# Altium schematic sheet SAMD21_Xplained_Pro_Target_MCU.SchDoc: Target MCU
size A3; Organization: ATMEL Norway; Address1: Vestre Rosten 79; Address2: N-7075 TILLER; Address3: NORWAY; DocumentNumber: A09-2130; Revision: 2; SheetNumber: 4; SheetTotal: 5; PageSetup: Record=PageOptions|CenterHorizontal=True|CenterVertical=True|PrintScale=1.01|XCorrection=1.00|YCorrection=1.00|PrintKind=1|BorderSize=5000000|LeftOffset=0|BottomOffset=0|Orientation=2|PaperLength=1000|PaperWidth=1000|Scale=100|PaperSource=7|PrintQuality=-4|MediaType=1|DitherType=10|PaperKind=A3 (297 x 420 mm)|PrintScaleMode=1
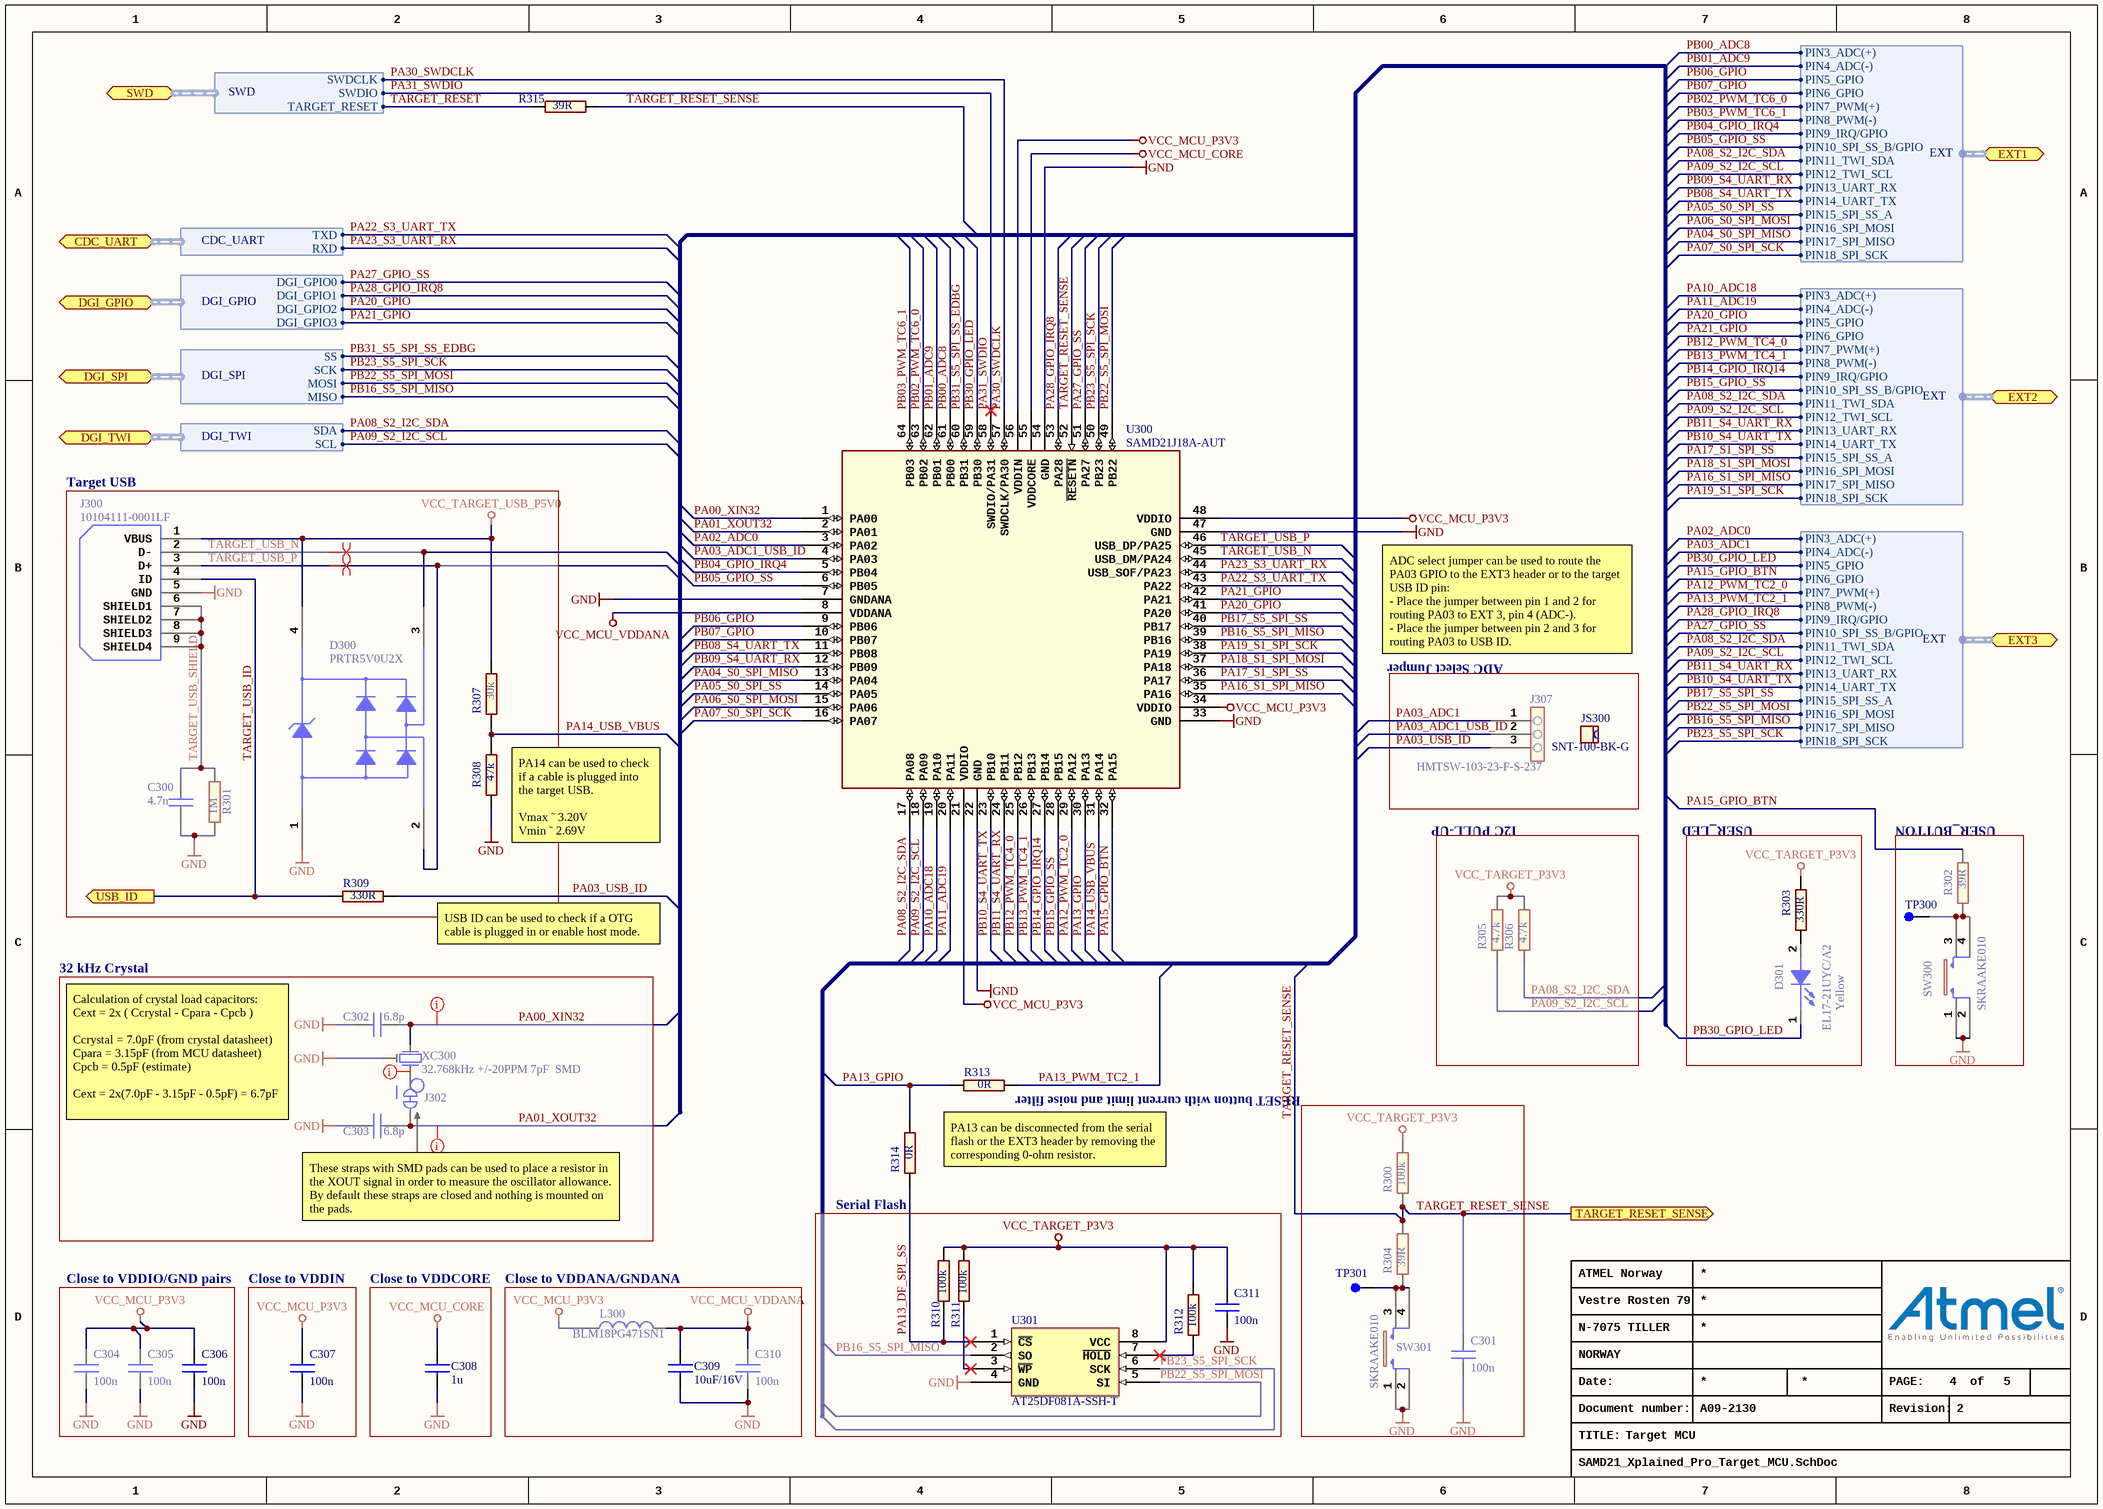
[diagram p0: SAMD21_Xplained_Pro_Target_MCU.SchDoc]

## Parts
C300  value 4.7n  [AP1-00053]  (hidden comment: CAP-NONPOL)
C301  100n  [AP1-00053]
C302  value 6.8p  [AP1-00001]  (hidden comment: CAP-NONPOL)
C303  value 6.8p  [AP1-00001]  (hidden comment: CAP-NONPOL)
C304  value 100n  [AP1-00001]  (hidden comment: CAP-NONPOL)
C305  value 100n  [AP1-00001]  (hidden comment: CAP-NONPOL)
C306  value 100n  [AP1-00001]  (hidden comment: CAP-NONPOL)
C307  value 100n  [AP1-00001]  (hidden comment: CAP-NONPOL)
C308  value 1u  [AP1-00001]  (hidden comment: CAP-NONPOL)
C309  value 10uF/16V  [AP1-00039]  (hidden comment: CAP-NONPOL)
C310  value 100n  [AP1-00001]  (hidden comment: CAP-NONPOL)
C311  100n  [AP1-00001]
D300  PRTR5V0U2X  [AP4-00001]
D301  Yellow  value EL17-21UYC/A2  [AP4-00013]
J300  value 10104111-0001LF  [AP8-00604]  (hidden comment: USB_AB)
J302  (no value)  [AP9-00044]  (net tie, no BOM)
J307  value HMTSW-103-23-F-S-237  [AP8-00745]  (hidden comment: Same as A08-1614 but with 1mm hole for optimal reflow soldering (no misalignment of the component))
JS300  value SNT-100-BK-G  [AP8-00525]
L300  BLM18PG471SN1  [AP3-00005]
R300  value 100k  [AP2-00011]  (hidden comment: R2)
R301  value 1M  [AP2-00011]  (hidden comment: R2)
R302  value 39R  [AP2-00011]  (hidden comment: R2)
R303  value 330R  [AP2-00000]  (hidden comment: R2)
R304  value 39R  [AP2-00011]  (hidden comment: R2)
R305  value 4.7k  [AP2-00000]  (hidden comment: R2)
R306  value 4.7k  [AP2-00000]  (hidden comment: R2)
R307  value 30k  [AP2-00000]  (hidden comment: R2)
R308  value 47k  [AP2-00000]  (hidden comment: R2)
R309  value 330R  [AP2-00000]  (hidden comment: R2)
R310  value 100k  [AP2-00000]  (hidden comment: R2)
R311  value 100k  [AP2-00000]  (hidden comment: R2)
R312  value 100k  [AP2-00000]  (hidden comment: R2)
R313  value 0R  [AP2-00000]  (hidden comment: R2)
R314  value 0R  [AP2-00000]  (hidden comment: R2)
R315  value 39R  [AP2-00011]  (hidden comment: R2)
SW300  value SKRAAKE010  [AP8-00137]  (hidden comment: Can be ordered in low volumes from Mouser)
SW301  value SKRAAKE010  [AP8-00137]  (hidden comment: Can be ordered in low volumes from Mouser)
TP300  TESTPOINT  [AP8-00010]  (value not drawn)  (no BOM)
TP301  TESTPOINT  [AP8-00010]  (value not drawn)  (no BOM)
U300  value SAMD21J18A-AUT  [AP6-00173]  (hidden comment: TQFP64)
U301  value AT25DF081A-SSH-T  [AP8-00417]  (hidden comment: AT25DF081A)
XC300  value 32.768kHz +/-20PPM 7pF  SMD  [AP7-00044]  (hidden comment: Farnell order no:1539364)

## Blocks framed on the sheet
Target USB: C300 D300 J300 R301 R307-R309
ADC Select Jumper: J307 JS300
I2C PULL-UP: R305 R306
USER_LED: D301 R303
USER_BUTTON: R302 SW300 TP300
32 kHz Crystal: C302 C303 J302 XC300
RESET button with current limit and noise filter: C301 R300 R304 SW301 TP301
Serial Flash: C311 R310-R312 U301
Close to VDDIO/GND pairs: C304-C306
Close to VDDIN: C307
Close to VDDCORE: C308
Close to VDDANA/GNDANA: C309 C310 L300

## Ports
CDC_UART (harness CDC_UART), DGI_GPIO (harness DGI_GPIO), DGI_SPI (harness DGI_SPI), DGI_TWI (harness DGI_TWI), EXT1 (harness EXT), EXT2 (harness EXT), EXT3 (harness EXT), SWD (harness SWD), TARGET_RESET_SENSE (out), USB_ID (out)

## Harnesses
SWD: SWDCLK, SWDIO, TARGET_RESET
DGI_GPIO: DGI_GPIO0, DGI_GPIO1, DGI_GPIO2, DGI_GPIO3
DGI_SPI: MISO, MOSI, SCK, SS
DGI_TWI: SCL, SDA
CDC_UART: RXD, TXD
EXT: PIN10_SPI_SS_B/GPIO, PIN11_TWI_SDA, PIN12_TWI_SCL, PIN13_UART_RX, PIN14_UART_TX, PIN15_SPI_SS_A, PIN16_SPI_MOSI, PIN17_SPI_MISO, PIN18_SPI_SCK, PIN3_ADC(+), PIN4_ADC(-), PIN5_GPIO, PIN6_GPIO, PIN7_PWM(+), PIN8_PWM(-), PIN9_IRQ/GPIO

## Nets
GND: C300.1 C301.2 C302.2 C303.2 C304.2 C305.2 C306.2 C307.2 C308.2 C309.2 C310.2 C311.2 D300.1(GND) J300.5(GND) R301.1 R308.1 SW300.1 SW300.2 SW301.1 SW301.2 U300.7(GNDANA) U300.22(GND) U300.33(GND) U300.47(GND) U300.54(GND) U301.4(GND) XC300.3
VCC_MCU_CORE: C308.1 U300.55(VDDCORE)
VCC_MCU_P3V3: C304.1 C305.1 C306.1 C307.1 L300.1 U300.21(VDDIO) U300.34(VDDIO) U300.48(VDDIO) U300.56(VDDIN)
VCC_MCU_VDDANA: C309.1 C310.1 L300.2 U300.8(VDDANA)
VCC_TARGET_P3V3: C311.1 R300.2 R303.2 R305.2 R306.2 R310.1 R311.1 R312.2 U301.8(VCC)
VCC_TARGET_USB_P5V0: D300.4(VCC) J300.1(VBUS) R307.2
PA00_XIN32: C302.1 U300.1(PA00) XC300.2
PA01_XOUT32: C303.1 J302.2 U300.2(PA01)
PA02_ADC0: U300.3(PA02) ; port EXT3.PIN3_ADC(+)
PA03_ADC1: J307.1 ; port EXT3.PIN4_ADC(-)
PA03_ADC1_USB_ID: J307.2 U300.4(PA03)
PA03_USB_ID: J307.3 R309.2
PA04_S0_SPI_MISO: U300.13(PA04) ; port EXT1.PIN17_SPI_MISO
PA05_S0_SPI_SS: U300.14(PA05) ; port EXT1.PIN15_SPI_SS_A
PA06_S0_SPI_MOSI: U300.15(PA06) ; port EXT1.PIN16_SPI_MOSI
PA07_S0_SPI_SCK: U300.16(PA07) ; port EXT1.PIN18_SPI_SCK
PA08_S2_I2C_SDA: R306.1 U300.17(PA08) ; port DGI_TWI.SDA, port EXT1.PIN11_TWI_SDA, port EXT2.PIN11_TWI_SDA, port EXT3.PIN11_TWI_SDA
PA09_S2_I2C_SCL: R305.1 U300.18(PA09) ; port DGI_TWI.SCL, port EXT1.PIN12_TWI_SCL, port EXT2.PIN12_TWI_SCL, port EXT3.PIN12_TWI_SCL
PA10_ADC18: U300.19(PA10) ; port EXT2.PIN3_ADC(+)
PA11_ADC19: U300.20(PA11) ; port EXT2.PIN4_ADC(-)
PA12_PWM_TC2_0: U300.29(PA12) ; port EXT3.PIN7_PWM(+)
PA13_DF_SPI_SS: R310.2 R314.1 U301.1(~{CS})
PA13_GPIO: R313.2 R314.2 U300.30(PA13)
PA13_PWM_TC2_1: R313.1 ; port EXT3.PIN8_PWM(-)
PA14_USB_VBUS: R307.1 R308.2 U300.31(PA14)
PA15_GPIO_BTN: R302.2 U300.32(PA15) ; port EXT3.PIN6_GPIO
PA16_S1_SPI_MISO: U300.35(PA16) ; port EXT2.PIN17_SPI_MISO
PA17_S1_SPI_SS: U300.36(PA17) ; port EXT2.PIN15_SPI_SS_A
PA18_S1_SPI_MOSI: U300.37(PA18) ; port EXT2.PIN16_SPI_MOSI
PA19_S1_SPI_SCK: U300.38(PA19) ; port EXT2.PIN18_SPI_SCK
PA20_GPIO: U300.41(PA20) ; port DGI_GPIO.DGI_GPIO2, port EXT2.PIN5_GPIO
PA21_GPIO: U300.42(PA21) ; port DGI_GPIO.DGI_GPIO3, port EXT2.PIN6_GPIO
PA22_S3_UART_TX: U300.43(PA22) ; port CDC_UART.TXD
PA23_S3_UART_RX: U300.44(USB_SOF/PA23) ; port CDC_UART.RXD
PA27_GPIO_SS: U300.51(PA27) ; port DGI_GPIO.DGI_GPIO0, port EXT3.PIN10_SPI_SS_B/GPIO
PA28_GPIO_IRQ8: U300.53(PA28) ; port DGI_GPIO.DGI_GPIO1, port EXT3.PIN9_IRQ/GPIO
PA30_SWDCLK: U300.57(SWDCLK/PA30) ; port SWD.SWDCLK
PA31_SWDIO: U300.58(SWDIO/PA31) ; port SWD.SWDIO
PB00_ADC8: U300.61(PB00) ; port EXT1.PIN3_ADC(+)
PB01_ADC9: U300.62(PB01) ; port EXT1.PIN4_ADC(-)
PB02_PWM_TC6_0: U300.63(PB02) ; port EXT1.PIN7_PWM(+)
PB03_PWM_TC6_1: U300.64(PB03) ; port EXT1.PIN8_PWM(-)
PB04_GPIO_IRQ4: U300.5(PB04) ; port EXT1.PIN9_IRQ/GPIO
PB05_GPIO_SS: U300.6(PB05) ; port EXT1.PIN10_SPI_SS_B/GPIO
PB06_GPIO: U300.9(PB06) ; port EXT1.PIN5_GPIO
PB07_GPIO: U300.10(PB07) ; port EXT1.PIN6_GPIO
PB08_S4_UART_TX: U300.11(PB08) ; port EXT1.PIN14_UART_TX
PB09_S4_UART_RX: U300.12(PB09) ; port EXT1.PIN13_UART_RX
PB10_S4_UART_TX: U300.23(PB10) ; port EXT2.PIN14_UART_TX, port EXT3.PIN14_UART_TX
PB11_S4_UART_RX: U300.24(PB11) ; port EXT2.PIN13_UART_RX, port EXT3.PIN13_UART_RX
PB12_PWM_TC4_0: U300.25(PB12) ; port EXT2.PIN7_PWM(+)
PB13_PWM_TC4_1: U300.26(PB13) ; port EXT2.PIN8_PWM(-)
PB14_GPIO_IRQ14: U300.27(PB14) ; port EXT2.PIN9_IRQ/GPIO
PB15_GPIO_SS: U300.28(PB15) ; port EXT2.PIN10_SPI_SS_B/GPIO
PB16_S5_SPI_MISO: U300.39(PB16) U301.2(SO) ; port DGI_SPI.MISO, port EXT3.PIN17_SPI_MISO
PB17_S5_SPI_SS: U300.40(PB17) ; port EXT3.PIN15_SPI_SS_A
PB22_S5_SPI_MOSI: U300.49(PB22) U301.5(SI) ; port DGI_SPI.MOSI, port EXT3.PIN16_SPI_MOSI
PB23_S5_SPI_SCK: U300.50(PB23) U301.6(SCK) ; port DGI_SPI.SCK, port EXT3.PIN18_SPI_SCK
PB30_GPIO_LED: D301.1(CATHODE) U300.59(PB30) ; port EXT3.PIN5_GPIO
PB31_S5_SPI_SS_EDBG: U300.60(PB31) ; port DGI_SPI.SS
TARGET_RESET: R315.1 ; port SWD.TARGET_RESET
TARGET_RESET_SENSE: C301.1 R300.1 R304.2 R315.2 U300.52(~{RESETN}) ; port TARGET_RESET_SENSE
TARGET_USB_ID: J300.4(ID) R309.1 ; port USB_ID
TARGET_USB_N: D300.3(I/O_2) J300.2(D-) U300.45(USB_DM/PA24)
TARGET_USB_P: D300.2(I/O_1) J300.3(D+) U300.46(USB_DP/PA25)
TARGET_USB_SHIELD: C300.2 J300.6(SHIELD1) J300.7(SHIELD2) J300.8(SHIELD3) J300.9(SHIELD4) R301.2
NetD301_2: D301.2(ANODE) R303.1
NetJ302_1: J302.1 XC300.1
NetR302_1: R302.1 SW300.3 SW300.4 TP300.1
NetR304_1: R304.1 SW301.3 SW301.4 TP301.1
NetR311_2: R311.2 U301.3(~{WP})
NetR312_1: R312.1 U301.7(~{HOLD})

## Layout directives
rule Assembly Testpoint Usage [Testpoint - Not Allowed    Multiple - Not Allowed]: NetJ302_1, PA00_XIN32, PA01_XOUT32
differential pair; rule Assembly Testpoint Usage [Testpoint - Not Allowed    Multiple - Not Allowed]: TARGET_USB_N, TARGET_USB_P

## Notes on the sheet
- ADC select jumper can be used to route the PA03 GPIO to the EXT3 header or to the target USB ID pin:
  - Place the jumper between pin 1 and 2 for routing PA03 to EXT 3, pin 4 (ADC-).
  - Place the jumper between pin 2 and 3 for routing PA03 to USB ID.
- (near R308) PA14 can be used to check
  if a cable is plugged into
  the target USB.
  Vmax ˜ 3.20V
  Vmin ˜ 2.69V
- USB ID can be used to check if a OTG cable is plugged in or enable host mode.
- Calculation of crystal load capacitors:
  Cext = 2x ( Ccrystal - Cpara - Cpcb )
  Ccrystal = 7.0pF (from crystal datasheet)
  Cpara = 3.15pF (from MCU datasheet)
  Cpcb = 0.5pF (estimate)
  Cext = 2x(7.0pF - 3.15pF - 0.5pF) = 6.7pF
- PA13 can be disconnected from the serial flash or the EXT3 header by removing the corresponding 0-ohm resistor.
- These straps with SMD pads can be used to place a resistor in the XOUT signal in order to measure the oscillator allowance.
  By default these straps are closed and nothing is mounted on the pads.
- Date:
- PAGE:
- of
- TITLE:
- Document number:
- Revision:

## Library data of the parts
C300 = A01-0046: Ceramic capacitor, SMD 0402, X7R, 25V, +/-10%; PartGroup: Capacitors,Ceramic,SMD 0402; TemperatureRange: -55 - +125 deg C; AN: A01-0046; Tolerance: 25V, +/-10%; Height: 0.550000011920929
C301 C304-C307 C310 C311 = A01-0246: Ceramic capacitor, SMD 0402, X7R, 16V, +/-10%; PartGroup: Capacitors,Ceramic,SMD 0402; Manufacturer: Kemet; MPN: C0402C104K4RACTU; TemperatureRange: -55 - +125 deg C; AN: A01-0246; Tolerance: 16V, +/-10%; Height: 0,5
  C301 C311: Value: 100n
C302 C303 = A01-0013: Ceramic capacitor, SMD 0402, NP0, 50V, +/-5%; PartGroup: Capacitors,Ceramic,SMD 0402; TemperatureRange: -55 - +125 deg C; AN: A01-0013; Tolerance: 50V, +/-5%; Height: 0,550000011920929
C308 = A01-0286: Ceramic capacitor, SMD 0402, X5R, 6.3V, +/-10% (de26942); PartGroup: Capacitors,Ceramic,SMD 0402; Manufacturer: Kemet; MPN: C0402C105K9PAC; TemperatureRange: -55 to 85 deg C; AN: A01-0286; Tolerance: +/-10%; Height: 0,5
C309 = A01-0491: Ceramic capacitor, SMD 0603, X5R, 16V, 10UF ± 20% (High Density); PartGroup: Capacitors,Ceramic,SMD 0603; Manufacturer: Taiyo Yuden; MPN: EMK107BBJ106MA-T; AN: A01-0491
D300 = A06-0236: Double rail-to-rail USB ESD protection diode; OrcadPartType: Integrated Circuits&Special function&Protection; Manufacturer: Philips; TemperatureRange: -40 to +85 C; AN: A06-0236; Value: PRTR5V0U2X; PartType: Buy; Height: 1,10000002384186; MPN: PRTR5V0U2X
D301 = A10-0019: LED, Yellow, Wave length=591nm, SMD 0805, ±70°; PartGroup: Opto,LEDs,SMD; Manufacturer: Everlight; MPN: 17-21UYC/S530-A3/TR8; TemperatureRange: -40 to +85 deg C; AN: A10-0019; Height: 1,10000002384186
J300 = A08-1368: Micro USB AB Connector; PartGroup: Mechanical devices,Connectors,USB; Manufacturer: FCI; AN: A08-1368; Height: 2.59999990463257; MPN: 10104111-0001LF
J302 = A09-0783: Default closed SMD strap, 0603 size; PartGroup: Mechanical devices,PCB implemented components; Value: SMD-STRAP_0603_CLOSED; AN: A09-0783; Height: 0
J307 = A08-1799: 1x3 pin header, 2.54mm pitch, Pin-in-Paste THM, 1mm hole; PartGroup: Mechanical devices,Connectors,Pin headers; Manufacturer: SAMTEC; AN: A08-1799; Height: 6,09999990463257; MPN: HMTSW-103-23-F-S-237
JS300 = A08-0543: Jumper cap for 2.54mm pinheader; PartGroup: Mechanical devices,Mounting accessories,Other; Manufacturer: SAMTEC; AN: A08-0543; MPN: SNT-100-BK-G
L300 = A03-0035: SMD RF inductor 0603. Z=470Ohm (@100MHz), Max R(dc)=0.65Ohm, Max current=1A; PartGroup: Inductors,EMI; Manufacturer: Murata; Tolerance: ±25%; TemperatureRange: -55°C to +125°C; AN: A03-0035; Value: BLM18PG471SN1; Height: 0,800000011920929; MPN: BLM18PG471SN1
R300 R310-R312 = A02-0260: Thick film resistor, SMD 0402, 1/16W, 1%; PartGroup: Resistors,SMD,0402 1%; TemperatureRange: -55 - +125 deg C; AN: A02-0260; Tolerance: 1 %; Height: 0,349999994039536
R301 = A02-0284: Thick film resistor, SMD 0402, 1/16W, 1%; PartGroup: Resistors,SMD,0402 1%; Manufacturer: KOA; MPN: RK73H1ETTP1004F; TemperatureRange: -55 - +125 deg C; AN: A02-0284; Tolerance: 1 %; Height: 0,349999994039536
R302 R304 R315 = A02-0178: Thick film resistor, SMD 0402, 1/16W, 1%; PartGroup: Resistors,SMD,0402 1%; TemperatureRange: -55 - +125 deg C; AN: A02-0178; Tolerance: 1 %; Height: 0,349999994039536
R303 R309 = A02-0200: Thick film resistor, SMD 0402, 1/16W, 1%; PartGroup: Resistors,SMD,0402 1%; TemperatureRange: -55 - +125 deg C; AN: A02-0200; Tolerance: 1 %; Height: 0.349999994039536
R305 R306 = A02-0228: Thick film resistor, SMD 0402, 1/16W, 1%; PartGroup: Resistors,SMD,0402 1%; TemperatureRange: -55 - +125 deg C; AN: A02-0228; Tolerance: 1 %; Height: 0.349999994039536
R307 = A02-0247: Thick film resistor, SMD 0402, 1/16W, 1%; PartGroup: Resistors,SMD,0402 1%; TemperatureRange: -55 - +125 deg C; AN: A02-0247; Tolerance: 1 %; Height: 0.349999994039536
R308 = A02-0252: Thick film resistor, SMD 0402, 1/16W, 1%; PartGroup: Resistors,SMD,0402 1%; TemperatureRange: -55 - +125 deg C; AN: A02-0252; Tolerance: 1 %; Height: 0.349999994039536
R313 R314 = A02-0163: RES 0.0 OHM 1/16W 0402 SMD; PartGroup: Resistors,SMD,0402 1%; MPN: RMCF0402ZT0R00; Tolerance: 1 %; TemperatureRange: -55 - +125 deg C; AN: A02-0163; Height: 0.349999994039536
SW300 SW301 = A08-0790: 6.2x6.2 mm SMD tact switch, same as A08-0091 but less force is needed; PartGroup: Mechanical devices,Switches,SMD; Manufacturer: ALPS; TemperatureRange: -30 - +90 deg C; AN: A08-0790; Height: 5,09999990463257; MPN: SKRAAKE010
TP300 TP301 = A08-0004: Single SMD testpad; PartGroup: Mechanical devices,Connectors,Test points; AN: A08-0004; Value: TESTPAD; Height: 0
U300 = A06-1041: Atmel 32-bit RISC MCU 64pin; PartGroup: Integrated Circuits,MCU, MPU, DSP,ARM MCU; TemperatureRange: -40°C to +85°C; Design comment: *; AN: A06-1041; Height: 1.20000004768372; Manufacturer: ATMEL; MPN: SAMD21J18A-AUT
U301 = A06-1051: 8Mbit SPI serial flash memory; PartGroup: Integrated Circuits,Memory,FLASH; Manufacturer: Adesto Technologies; TemperatureRange: -40°C to +85°C; AN: A06-1051; Height: 1.75; MPN: AT25DF081A-SSH-T
XC300 = A07-0052: 32k768 crystal, +-20ppm, CL=7pF, max ESR 60kOhm, SMD; PartGroup: Frequency devices,Crystals,SMD; Manufacturer: Micro Crystal; MPN: MS1V-T1K 32.768kHz 7pF +/-20PPM TA; Tolerance: +/- 20 PPM; TemperatureRange: -40 /+85; AN: A07-0052; Height: 2.07999992370605